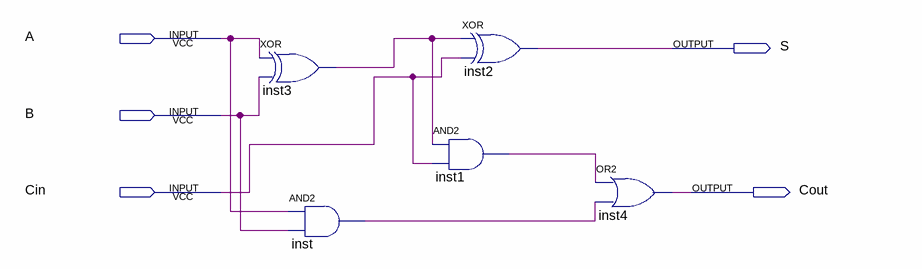
[diagram p0: schematic sheet]
// Quartus schematic somador_subtrator5bit.bdf as structural Verilog: 5 symbols, 5 pins
module somador_subtrator5bit (
  input  A,
  input  B,
  input  Cin,
  output S,
  output Cout
);

  wire inst1_out, inst3_out, inst_out;

  xor inst3 (inst3_out, A, B);
  and inst (inst_out, A, B);
  xor inst2 (S, inst3_out, Cin);
  and inst1 (inst1_out, inst3_out, Cin);
  or inst4 (Cout, inst1_out, inst_out);
endmodule
